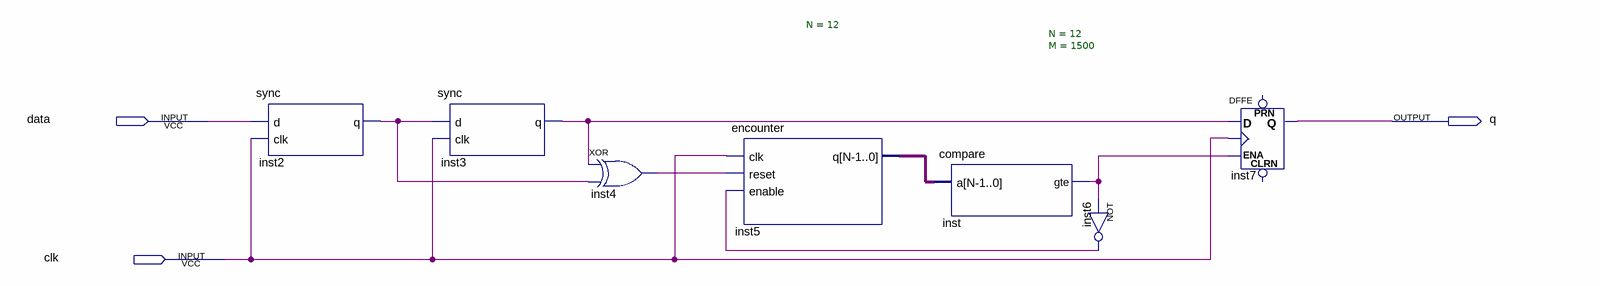
[diagram p0: schematic sheet]
// Quartus schematic checker.bdf as structural Verilog: 7 symbols, 3 pins
module \checker  (
  input  data,
  input  clk,
  output q
);

  wire inst2_q, inst3_q, inst4_out, inst6_out, inst_gte;
  wire [11:0] inst5_q;

  sync inst2 (.d(data), .clk(clk), .q(inst2_q));
  sync inst3 (.d(inst2_q), .clk(clk), .q(inst3_q));
  xor inst4 (inst4_out, inst3_q, inst2_q);
  encounter #(.N(12)) inst5 (.clk(clk), .reset(inst4_out), .enable(inst6_out), .q(inst5_q));
  compare #(.N(12), .M(1500)) inst (.a(inst5_q), .gte(inst_gte));
  not inst6 (inst6_out, inst_gte);
  DFFE inst7 (.D(inst3_q), .CLK(clk), .ENA(inst_gte), .Q(q));  // open: PRN, CLRN
endmodule
